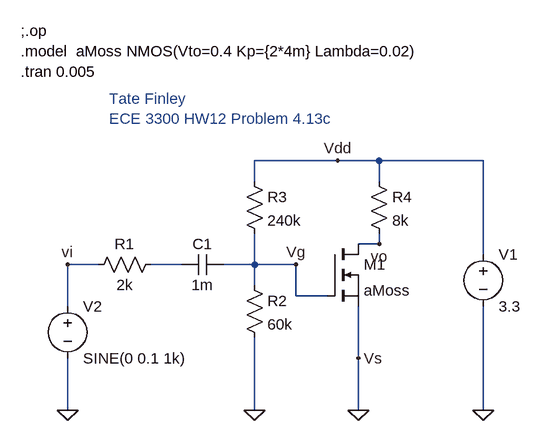
[diagram p0: schematic ECE3300HW12.asc]
ECE3300HW12.asc, the LTspice schematic file:
Version 4
SHEET 1 1668 680
WIRE 384 -80 256 -80
WIRE 448 -80 384 -80
WIRE 608 -80 448 -80
WIRE 256 -48 256 -80
WIRE 448 -48 448 -80
WIRE 448 48 448 32
WIRE 448 48 416 48
WIRE 608 64 608 -80
WIRE 16 80 -32 80
WIRE 144 80 96 80
WIRE 256 80 256 32
WIRE 256 80 208 80
WIRE 320 80 256 80
WIRE 256 112 256 80
WIRE 320 128 320 80
WIRE 368 128 320 128
WIRE -32 144 -32 80
WIRE 416 224 416 144
WIRE -32 304 -32 224
WIRE 256 304 256 192
WIRE 416 304 416 224
WIRE 608 304 608 144
FLAG 416 224 Vs
FLAG 320 80 Vg
FLAG 384 -80 Vdd
FLAG 448 48 vo
FLAG -32 80 vi
FLAG -32 304 0
FLAG 256 304 0
FLAG 416 304 0
FLAG 608 304 0
SYMBOL res 240 96 R0
SYMATTR InstName R2
SYMATTR Value 60k
SYMBOL res 240 -64 R0
SYMATTR InstName R3
SYMATTR Value 240k
SYMBOL res 432 -64 R0
SYMATTR InstName R4
SYMATTR Value 8k
SYMBOL nmos 368 48 R0
SYMATTR InstName M1
SYMATTR Value aMoss
SYMBOL voltage 608 48 R0
WINDOW 123 0 0 Left 0
WINDOW 39 0 0 Left 0
SYMATTR InstName V1
SYMATTR Value 3.3
SYMBOL voltage -32 128 R0
WINDOW 123 0 0 Left 0
WINDOW 39 0 0 Left 0
SYMATTR InstName V2
SYMATTR Value SINE(0 0.1 1k)
SYMBOL res 112 64 R90
WINDOW 0 0 56 VBottom 2
WINDOW 3 32 56 VTop 2
SYMATTR InstName R1
SYMATTR Value 2k
SYMBOL cap 208 64 R90
WINDOW 0 0 32 VBottom 2
WINDOW 3 32 32 VTop 2
SYMATTR InstName C1
SYMATTR Value 1m
TEXT -104 -280 Left 2 !;.op\n.model  aMoss NMOS(Vto=0.4 Kp={2*4m} Lambda=0.02)\n.tran 0.005
TEXT 32 -176 Left 2 ;Tate Finley\nECE 3300 HW12 Problem 4.13c

The netlist it stands for:
* ECE3300HW12.asc
R2 Vg 0 60k
R3 Vdd Vg 240k
R4 Vdd vo 8k
M1 vo Vg 0 0 aMoss
V1 Vdd 0 3.3
V2 vi 0 SINE(0 0.1 1k)
R1 N001 vi 2k
C1 Vg N001 1m
.model NMOS NMOS
.model PMOS PMOS
.lib standard.mos
;.op
.model  aMoss NMOS(Vto=0.4 Kp={2*4m} Lambda=0.02)
.tran 0.005
* Tate Finley
* ECE 3300 HW12 Problem 4.13c
.backanno
.end